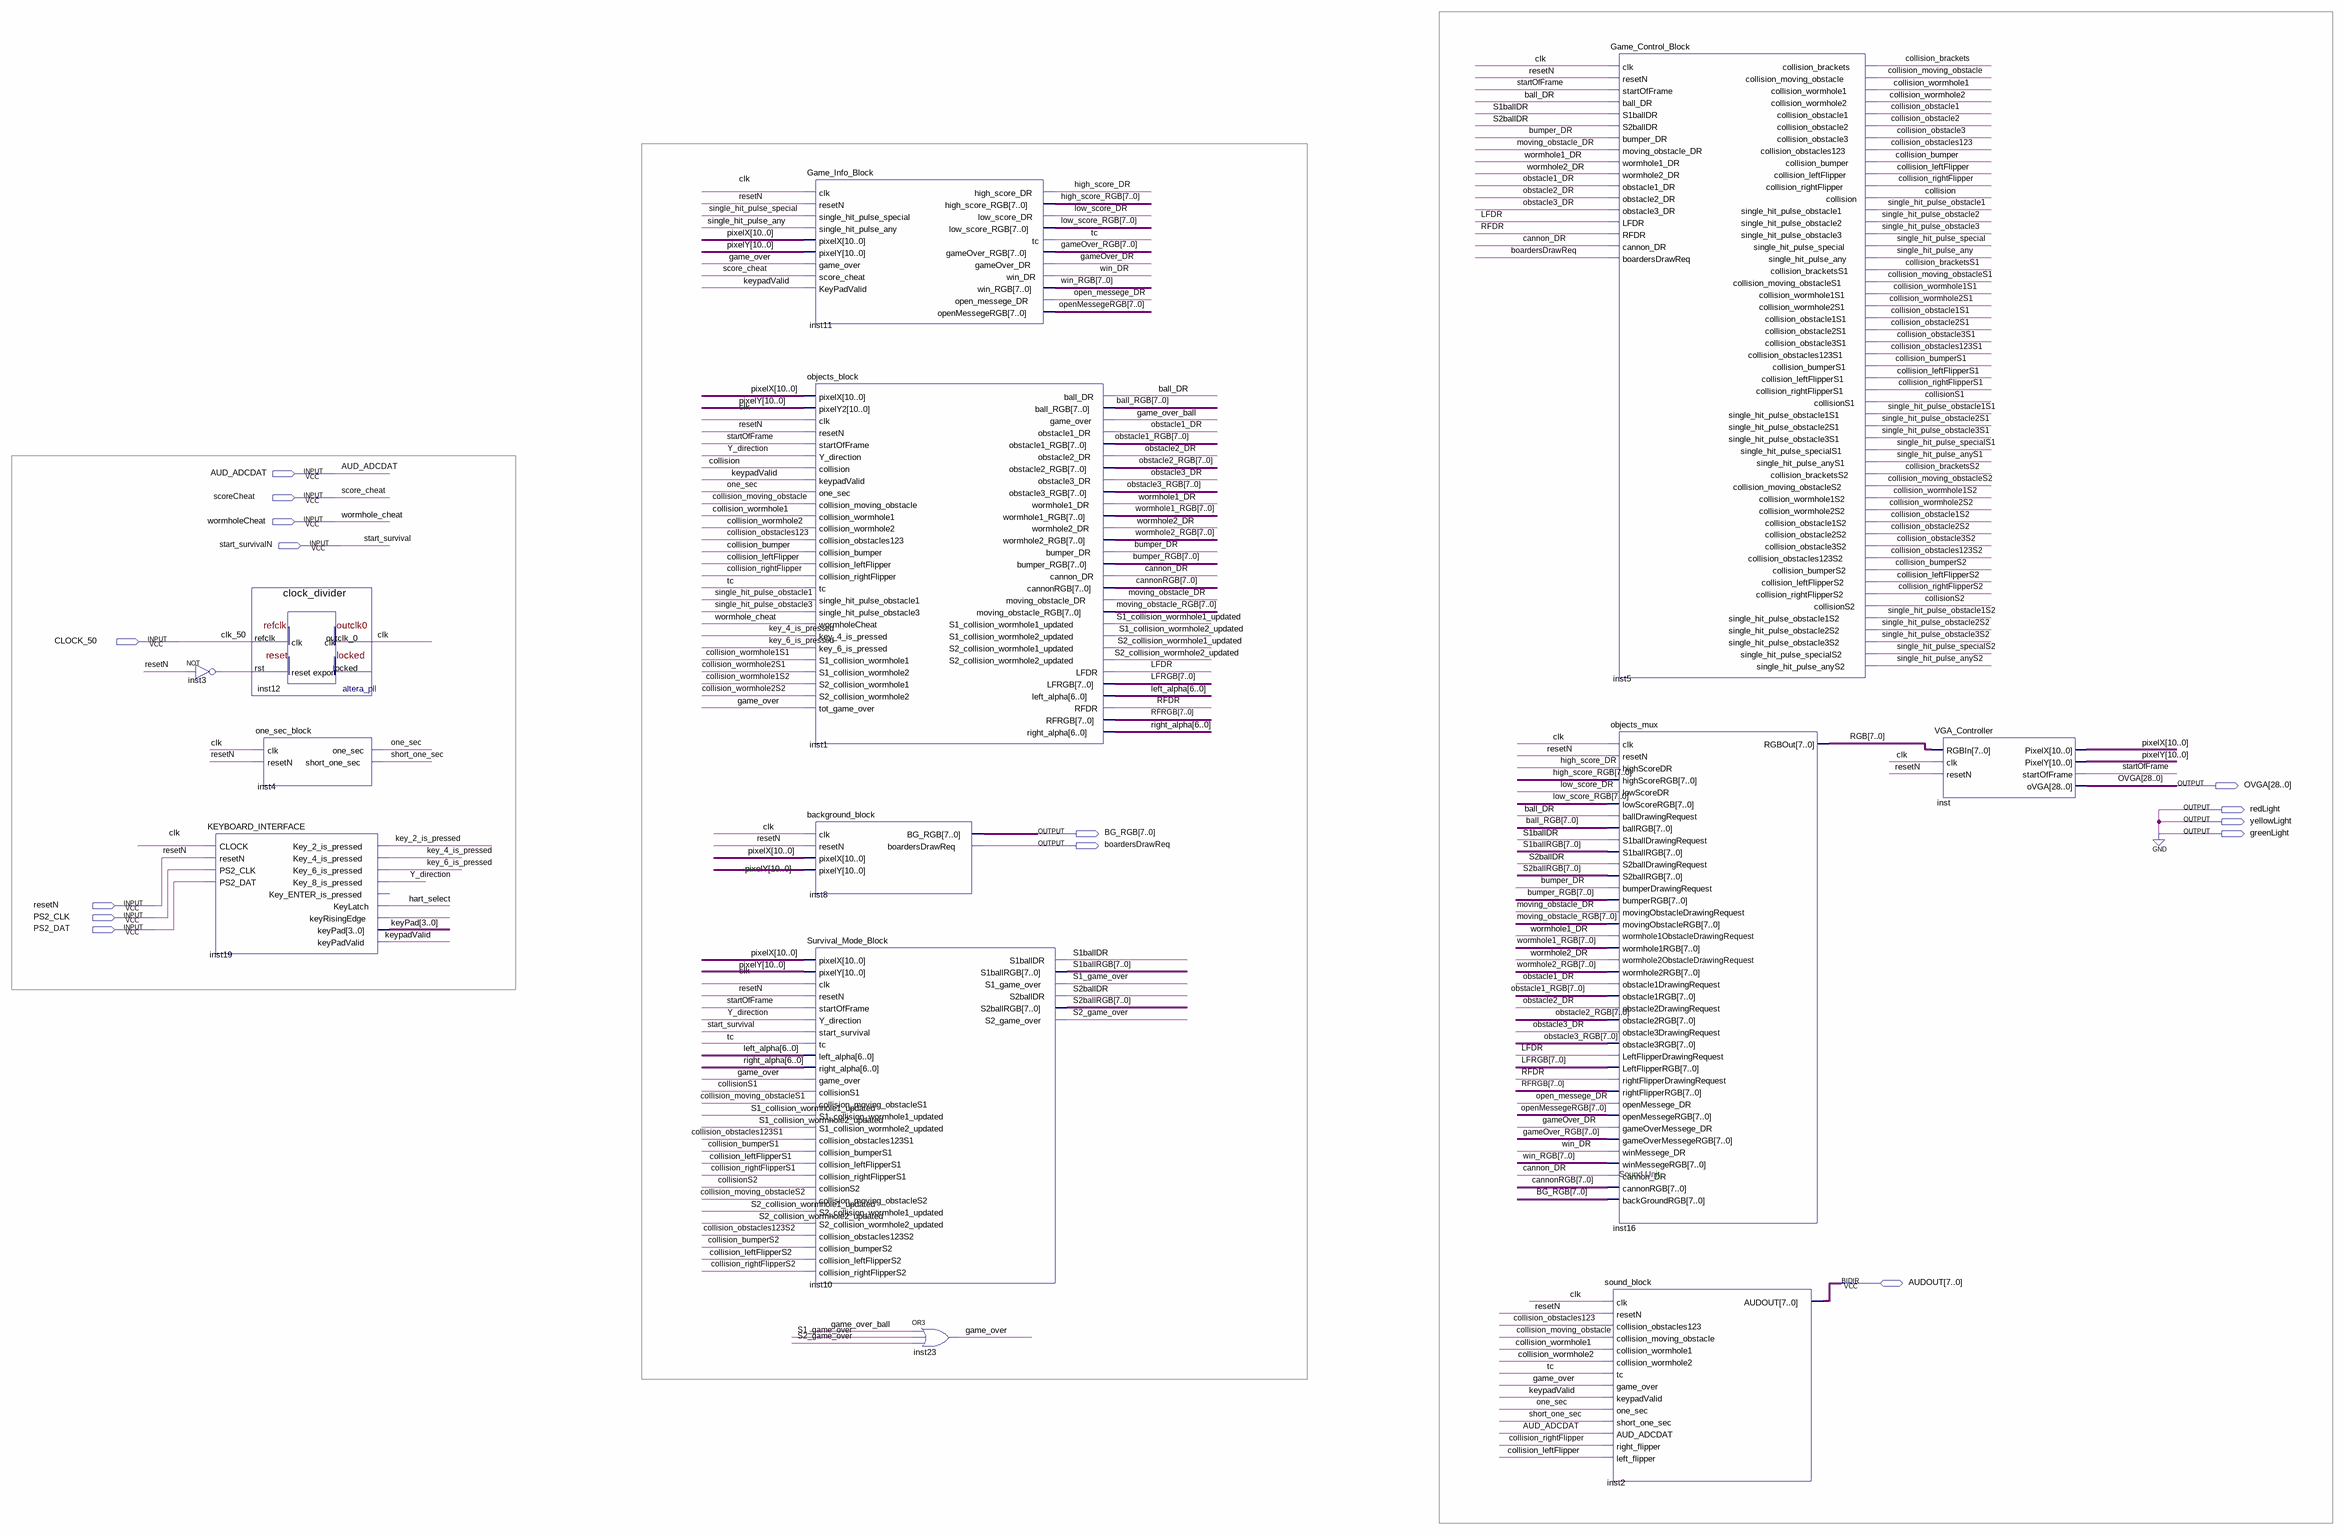
[diagram p0: schematic sheet]
// Quartus schematic TOP_VGA_DEMO_KBD.bdf as structural Verilog: 13 symbols, 15 pins
module TOP_VGA_DEMO_KBD (
  input  AUD_ADCDAT,
  input  scoreCheat,
  input  wormholeCheat,
  input  start_survivalN,
  input  CLOCK_50,
  input  resetN,
  input  PS2_CLK,
  input  PS2_DAT,
  inout  [7:0] AUDOUT,
  output [28:0] OVGA,
  output redLight,
  output yellowLight,
  output [7:0] BG_RGB,
  output greenLight,
  output boardersDrawReq
);

  wire ball_DR, bumper_DR, cannon_DR, clk, collision, collision_brackets, collision_bracketsS1,
       collision_bracketsS2, collision_bumper, collision_bumperS1, collision_bumperS2, collision_leftFlipper,
       collision_leftFlipperS1, collision_leftFlipperS2, collision_moving_obstacle,
       collision_moving_obstacleS1, collision_moving_obstacleS2, collision_obstacle1, collision_obstacle1S1,
       collision_obstacle1S2, collision_obstacle2, collision_obstacle2S1, collision_obstacle2S2,
       collision_obstacle3, collision_obstacle3S1, collision_obstacle3S2, collision_obstacles123,
       collision_obstacles123S1, collision_obstacles123S2, collision_rightFlipper, collision_rightFlipperS1,
       collision_rightFlipperS2, collision_wormhole1, collision_wormhole1S1, collision_wormhole1S2,
       collision_wormhole2, collision_wormhole2S1, collision_wormhole2S2, collisionS1, collisionS2,
       game_over, game_over_ball, gameOver_DR, hart_select, high_score_DR, inst3_out, inst19_keyrisingedge,
       key_2_is_pressed, key_4_is_pressed, key_6_is_pressed, keypadValid, LFDR, low_score_DR,
       moving_obstacle_DR, obstacle1_DR, obstacle2_DR, obstacle3_DR, one_sec, open_messege_DR, RFDR,
       S1_collision_wormhole1_updated, S1_collision_wormhole2_updated, S1_game_over, S1ballDR,
       S2_collision_wormhole1_updated, S2_collision_wormhole2_updated, S2_game_over, S2ballDR, short_one_sec,
       single_hit_pulse_any, single_hit_pulse_anyS1, single_hit_pulse_anyS2, single_hit_pulse_obstacle1,
       single_hit_pulse_obstacle1S1, single_hit_pulse_obstacle1S2, single_hit_pulse_obstacle2,
       single_hit_pulse_obstacle2S1, single_hit_pulse_obstacle2S2, single_hit_pulse_obstacle3,
       single_hit_pulse_obstacle3S1, single_hit_pulse_obstacle3S2, single_hit_pulse_special,
       single_hit_pulse_specialS1, single_hit_pulse_specialS2, startOfFrame, tc, win_DR, wormhole1_DR,
       wormhole2_DR, Y_direction;
  wire [3:0] keyPad;
  wire [6:0] left_alpha, right_alpha;
  wire [7:0] ball_RGB, bumper_RGB, cannonRGB, gameOver_RGB, high_score_RGB, LFRGB, low_score_RGB,
       moving_obstacle_RGB, obstacle1_RGB, obstacle2_RGB, obstacle3_RGB, openMessegeRGB, RFRGB, RGB,
       S1ballRGB, S2ballRGB, win_RGB, wormhole1_RGB, wormhole2_RGB;
  wire [10:0] pixelX, pixelY;

  not inst3 (inst3_out, resetN);
  KEYBOARD_INTERFACE inst19 (
    .CLOCK(clk), .resetN(resetN), .PS2_CLK(PS2_CLK), .PS2_DAT(PS2_DAT), .Key_2_is_pressed(key_2_is_pressed),
    .Key_4_is_pressed(key_4_is_pressed), .Key_6_is_pressed(key_6_is_pressed), .Key_8_is_pressed(Y_direction),
    .KeyLatch(hart_select), .keyRisingEdge(inst19_keyrisingedge), .keyPad(keyPad), .keyPadValid(keypadValid));  // open: Key_ENTER_is_pressed
  clock_divider inst12 (.refclk(CLOCK_50), .rst(inst3_out), .outclk_0(clk));  // open: locked
  one_sec_block inst4 (.clk(clk), .resetN(resetN), .one_sec(one_sec), .short_one_sec(short_one_sec));
  Game_Info_Block inst11 (
    .clk(clk), .resetN(resetN), .single_hit_pulse_special(single_hit_pulse_special),
    .single_hit_pulse_any(single_hit_pulse_any), .pixelX(pixelX), .pixelY(pixelY), .game_over(game_over),
    .score_cheat(scoreCheat), .KeyPadValid(keypadValid), .high_score_DR(high_score_DR),
    .high_score_RGB(high_score_RGB), .low_score_DR(low_score_DR), .low_score_RGB(low_score_RGB), .tc(tc),
    .gameOver_RGB(gameOver_RGB), .gameOver_DR(gameOver_DR), .win_DR(win_DR), .win_RGB(win_RGB),
    .open_messege_DR(open_messege_DR), .openMessegeRGB(openMessegeRGB));
  objects_block inst1 (
    .pixelX(pixelX), .pixelY2(pixelY), .clk(clk), .resetN(resetN), .startOfFrame(startOfFrame),
    .Y_direction(Y_direction), .collision(collision), .keypadValid(keypadValid), .one_sec(one_sec),
    .collision_moving_obstacle(collision_moving_obstacle), .collision_wormhole1(collision_wormhole1),
    .collision_wormhole2(collision_wormhole2), .collision_obstacles123(collision_obstacles123),
    .collision_bumper(collision_bumper), .collision_leftFlipper(collision_leftFlipper),
    .collision_rightFlipper(collision_rightFlipper), .tc(tc),
    .single_hit_pulse_obstacle1(single_hit_pulse_obstacle1),
    .single_hit_pulse_obstacle3(single_hit_pulse_obstacle3), .wormholeCheat(wormholeCheat),
    .key_4_is_pressed(key_4_is_pressed), .key_6_is_pressed(key_6_is_pressed),
    .S1_collision_wormhole1(collision_wormhole1S1), .S1_collision_wormhole2(collision_wormhole2S1),
    .S2_collision_wormhole1(collision_wormhole1S2), .S2_collision_wormhole2(collision_wormhole2S2),
    .tot_game_over(game_over), .ball_DR(ball_DR), .ball_RGB(ball_RGB), .game_over(game_over_ball),
    .obstacle1_DR(obstacle1_DR), .obstacle1_RGB(obstacle1_RGB), .obstacle2_DR(obstacle2_DR),
    .obstacle2_RGB(obstacle2_RGB), .obstacle3_DR(obstacle3_DR), .obstacle3_RGB(obstacle3_RGB),
    .wormhole1_DR(wormhole1_DR), .wormhole1_RGB(wormhole1_RGB), .wormhole2_DR(wormhole2_DR),
    .wormhole2_RGB(wormhole2_RGB), .bumper_DR(bumper_DR), .bumper_RGB(bumper_RGB), .cannon_DR(cannon_DR),
    .cannonRGB(cannonRGB), .moving_obstacle_DR(moving_obstacle_DR),
    .moving_obstacle_RGB(moving_obstacle_RGB),
    .S1_collision_wormhole1_updated(S1_collision_wormhole1_updated),
    .S1_collision_wormhole2_updated(S1_collision_wormhole2_updated),
    .S2_collision_wormhole1_updated(S2_collision_wormhole1_updated),
    .S2_collision_wormhole2_updated(S2_collision_wormhole2_updated), .LFDR(LFDR), .LFRGB(LFRGB),
    .left_alpha(left_alpha), .RFDR(RFDR), .RFRGB(RFRGB), .right_alpha(right_alpha));
  background_block inst8 (
    .clk(clk), .resetN(resetN), .pixelX(pixelX), .pixelY(pixelY), .BG_RGB(BG_RGB),
    .boardersDrawReq(boardersDrawReq));
  Survival_Mode_Block inst10 (
    .pixelX(pixelX), .pixelY(pixelY), .clk(clk), .resetN(resetN), .startOfFrame(startOfFrame),
    .Y_direction(Y_direction), .start_survival(start_survivalN), .tc(tc), .left_alpha(left_alpha),
    .right_alpha(right_alpha), .game_over(game_over), .collisionS1(collisionS1),
    .collision_moving_obstacleS1(collision_moving_obstacleS1),
    .S1_collision_wormhole1_updated(S1_collision_wormhole1_updated),
    .S1_collision_wormhole2_updated(S1_collision_wormhole2_updated),
    .collision_obstacles123S1(collision_obstacles123S1), .collision_bumperS1(collision_bumperS1),
    .collision_leftFlipperS1(collision_leftFlipperS1), .collision_rightFlipperS1(collision_rightFlipperS1),
    .collisionS2(collisionS2), .collision_moving_obstacleS2(collision_moving_obstacleS2),
    .S2_collision_wormhole1_updated(S2_collision_wormhole1_updated),
    .S2_collision_wormhole2_updated(S2_collision_wormhole2_updated),
    .collision_obstacles123S2(collision_obstacles123S2), .collision_bumperS2(collision_bumperS2),
    .collision_leftFlipperS2(collision_leftFlipperS2), .collision_rightFlipperS2(collision_rightFlipperS2),
    .S1ballDR(S1ballDR), .S1ballRGB(S1ballRGB), .S1_game_over(S1_game_over), .S2ballDR(S2ballDR),
    .S2ballRGB(S2ballRGB), .S2_game_over(S2_game_over));
  or inst23 (game_over, game_over_ball, S1_game_over, S2_game_over);
  Game_Control_Block inst5 (
    .clk(clk), .resetN(resetN), .startOfFrame(startOfFrame), .ball_DR(ball_DR), .S1ballDR(S1ballDR),
    .S2ballDR(S2ballDR), .bumper_DR(bumper_DR), .moving_obstacle_DR(moving_obstacle_DR),
    .wormhole1_DR(wormhole1_DR), .wormhole2_DR(wormhole2_DR), .obstacle1_DR(obstacle1_DR),
    .obstacle2_DR(obstacle2_DR), .obstacle3_DR(obstacle3_DR), .LFDR(LFDR), .RFDR(RFDR),
    .cannon_DR(cannon_DR), .boardersDrawReq(boardersDrawReq), .collision_brackets(collision_brackets),
    .collision_moving_obstacle(collision_moving_obstacle), .collision_wormhole1(collision_wormhole1),
    .collision_wormhole2(collision_wormhole2), .collision_obstacle1(collision_obstacle1),
    .collision_obstacle2(collision_obstacle2), .collision_obstacle3(collision_obstacle3),
    .collision_obstacles123(collision_obstacles123), .collision_bumper(collision_bumper),
    .collision_leftFlipper(collision_leftFlipper), .collision_rightFlipper(collision_rightFlipper),
    .collision(collision), .single_hit_pulse_obstacle1(single_hit_pulse_obstacle1),
    .single_hit_pulse_obstacle2(single_hit_pulse_obstacle2),
    .single_hit_pulse_obstacle3(single_hit_pulse_obstacle3),
    .single_hit_pulse_special(single_hit_pulse_special), .single_hit_pulse_any(single_hit_pulse_any),
    .collision_bracketsS1(collision_bracketsS1), .collision_moving_obstacleS1(collision_moving_obstacleS1),
    .collision_wormhole1S1(collision_wormhole1S1), .collision_wormhole2S1(collision_wormhole2S1),
    .collision_obstacle1S1(collision_obstacle1S1), .collision_obstacle2S1(collision_obstacle2S1),
    .collision_obstacle3S1(collision_obstacle3S1), .collision_obstacles123S1(collision_obstacles123S1),
    .collision_bumperS1(collision_bumperS1), .collision_leftFlipperS1(collision_leftFlipperS1),
    .collision_rightFlipperS1(collision_rightFlipperS1), .collisionS1(collisionS1),
    .single_hit_pulse_obstacle1S1(single_hit_pulse_obstacle1S1),
    .single_hit_pulse_obstacle2S1(single_hit_pulse_obstacle2S1),
    .single_hit_pulse_obstacle3S1(single_hit_pulse_obstacle3S1),
    .single_hit_pulse_specialS1(single_hit_pulse_specialS1), .single_hit_pulse_anyS1(single_hit_pulse_anyS1),
    .collision_bracketsS2(collision_bracketsS2), .collision_moving_obstacleS2(collision_moving_obstacleS2),
    .collision_wormhole1S2(collision_wormhole1S2), .collision_wormhole2S2(collision_wormhole2S2),
    .collision_obstacle1S2(collision_obstacle1S2), .collision_obstacle2S2(collision_obstacle2S2),
    .collision_obstacle3S2(collision_obstacle3S2), .collision_obstacles123S2(collision_obstacles123S2),
    .collision_bumperS2(collision_bumperS2), .collision_leftFlipperS2(collision_leftFlipperS2),
    .collision_rightFlipperS2(collision_rightFlipperS2), .collisionS2(collisionS2),
    .single_hit_pulse_obstacle1S2(single_hit_pulse_obstacle1S2),
    .single_hit_pulse_obstacle2S2(single_hit_pulse_obstacle2S2),
    .single_hit_pulse_obstacle3S2(single_hit_pulse_obstacle3S2),
    .single_hit_pulse_specialS2(single_hit_pulse_specialS2), .single_hit_pulse_anyS2(single_hit_pulse_anyS2));
  objects_mux inst16 (
    .clk(clk), .resetN(resetN), .highScoreDR(high_score_DR), .highScoreRGB(high_score_RGB),
    .lowScoreDR(low_score_DR), .lowScoreRGB(low_score_RGB), .ballDrawingRequest(ball_DR), .ballRGB(ball_RGB),
    .S1ballDrawingRequest(S1ballDR), .S1ballRGB(S1ballRGB), .S2ballDrawingRequest(S2ballDR),
    .S2ballRGB(S2ballRGB), .bumperDrawingRequest(bumper_DR), .bumperRGB(bumper_RGB),
    .movingObstacleDrawingRequest(moving_obstacle_DR), .movingObstacleRGB(moving_obstacle_RGB),
    .wormhole1ObstacleDrawingRequest(wormhole1_DR), .wormhole1RGB(wormhole1_RGB),
    .wormhole2ObstacleDrawingRequest(wormhole2_DR), .wormhole2RGB(wormhole2_RGB),
    .obstacle1DrawingRequest(obstacle1_DR), .obstacle1RGB(obstacle1_RGB),
    .obstacle2DrawingRequest(obstacle2_DR), .obstacle2RGB(obstacle2_RGB),
    .obstacle3DrawingRequest(obstacle3_DR), .obstacle3RGB(obstacle3_RGB), .LeftFlipperDrawingRequest(LFDR),
    .LeftFlipperRGB(LFRGB), .rightFlipperDrawingRequest(RFDR), .rightFlipperRGB(RFRGB),
    .openMessege_DR(open_messege_DR), .openMessegeRGB(openMessegeRGB), .gameOverMessege_DR(gameOver_DR),
    .gameOverMessegeRGB(gameOver_RGB), .winMessege_DR(win_DR), .winMessegeRGB(win_RGB),
    .cannon_DR(cannon_DR), .cannonRGB(cannonRGB), .backGroundRGB(BG_RGB), .RGBOut(RGB));
  sound_block inst2 (
    .clk(clk), .resetN(resetN), .collision_obstacles123(collision_obstacles123),
    .collision_moving_obstacle(collision_moving_obstacle), .collision_wormhole1(collision_wormhole1),
    .collision_wormhole2(collision_wormhole2), .tc(tc), .game_over(game_over), .keypadValid(keypadValid),
    .one_sec(one_sec), .short_one_sec(short_one_sec), .AUD_ADCDAT(AUD_ADCDAT),
    .right_flipper(collision_rightFlipper), .left_flipper(collision_leftFlipper), .AUDOUT(AUDOUT));
  VGA_Controller inst (
    .RGBIn(RGB), .clk(clk), .resetN(resetN), .PixelX(pixelX), .PixelY(pixelY), .startOfFrame(startOfFrame),
    .oVGA(OVGA));

  assign greenLight = 1'b0;
  assign redLight = 1'b0;
  assign yellowLight = 1'b0;

  // Other names for the same wires on the sheet: clk_50 = CLOCK_50; score_cheat = scoreCheat;
  //   start_survival = start_survivalN; wormhole_cheat = wormholeCheat

  // Notes on the sheet:
  //   Sound Unit
endmodule
